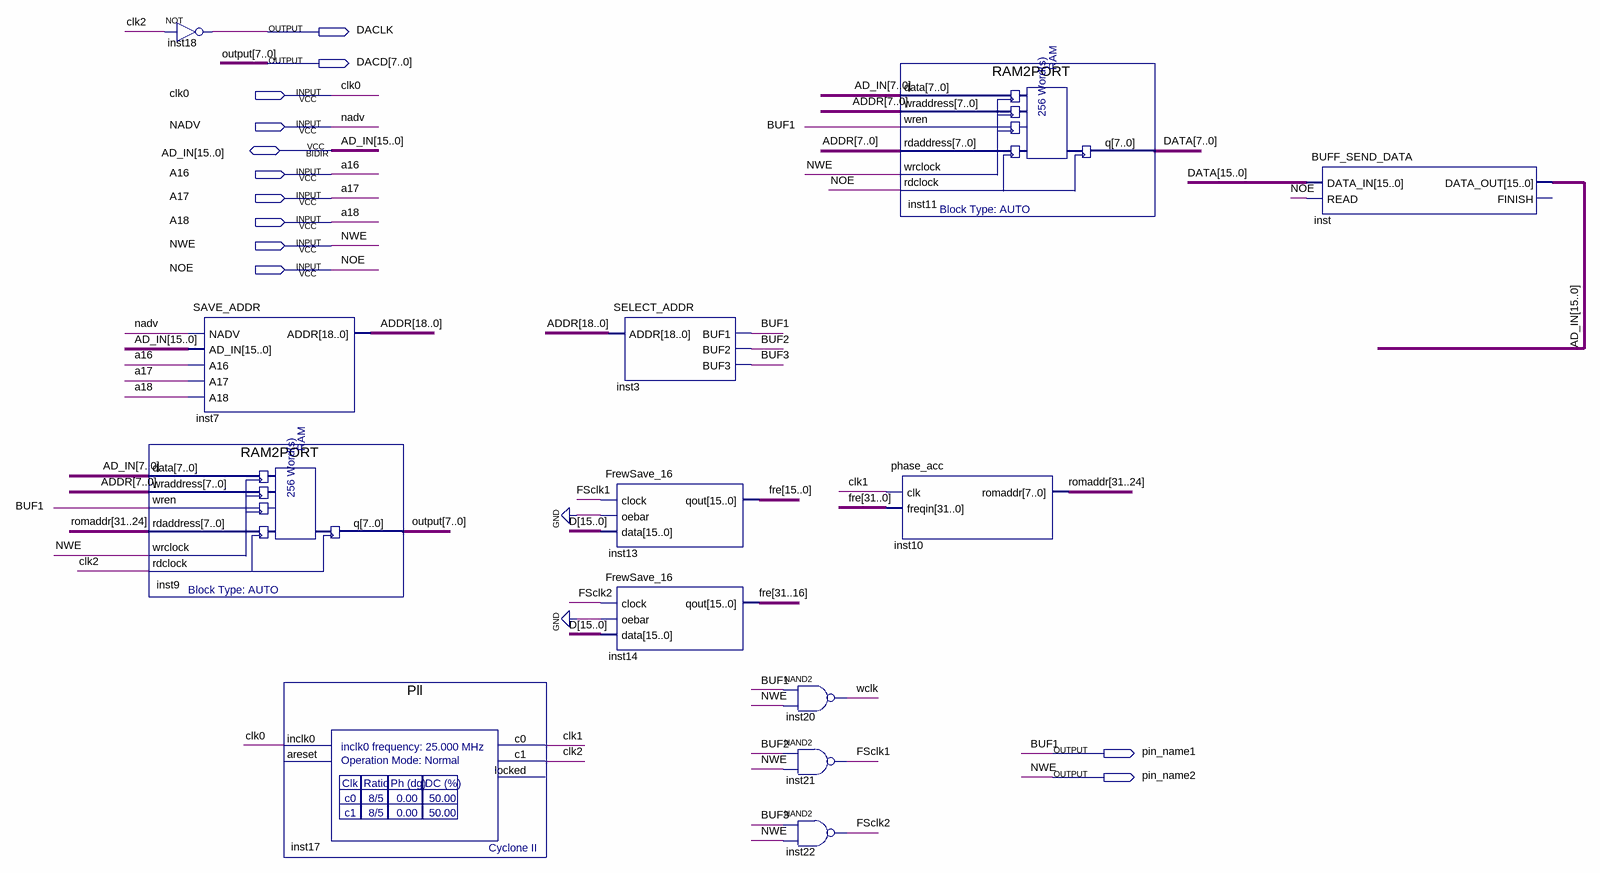
[diagram p0: schematic sheet]
// Quartus schematic dds_stm32.bdf as structural Verilog: 13 symbols, 12 pins
module dds_stm32 (
  input  clk0,
  input  NADV,
  input  A16,
  input  A17,
  input  A18,
  input  NWE,
  input  NOE,
  inout  [15:0] AD_IN,
  output DACLK,
  output [7:0] DACD,
  output pin_name1,
  output pin_name2
);

  wire BUF2, BUF3, clk1, clk2, FSclk1, FSclk2, wclk;
  wire [15:0] D, DATA;
  wire [18:0] ADDR;
  wire [31:0] fre;
  wire [31:24] romaddr;

  RAM2PORT inst9 (
    .data(AD_IN[7:0]), .wraddress(ADDR[7:0]), .wren(pin_name1), .rdaddress(romaddr), .wrclock(NWE),
    .rdclock(clk2), .q(DACD));
  not inst18 (DACLK, clk2);
  SAVE_ADDR inst7 (.NADV(NADV), .AD_IN(AD_IN), .A16(A16), .A17(A17), .A18(A18), .ADDR(ADDR));
  Pll inst17 (.inclk0(clk0), .c0(clk1), .c1(clk2));  // open: areset, locked
  SELECT_ADDR inst3 (.ADDR(ADDR), .BUF1(pin_name1), .BUF2(BUF2), .BUF3(BUF3));
  FrewSave_16 inst13 (.clock(FSclk1), .oebar(1'b0), .data(D), .qout(fre[15:0]));
  FrewSave_16 inst14 (.clock(FSclk2), .oebar(1'b0), .data(D), .qout(fre[31:16]));
  nand inst20 (wclk, pin_name1, NWE);
  nand inst21 (FSclk1, BUF2, NWE);
  nand inst22 (FSclk2, BUF3, NWE);
  RAM2PORT inst11 (
    .data(AD_IN[7:0]), .wraddress(ADDR[7:0]), .wren(pin_name1), .rdaddress(ADDR[7:0]), .wrclock(NWE),
    .rdclock(NOE), .q(DATA[7:0]));
  phase_acc inst10 (.clk(clk1), .freqin(fre), .romaddr(romaddr));
  BUFF_SEND_DATA inst (.DATA_IN(DATA), .READ(NOE), .DATA_OUT(AD_IN));  // open: FINISH

  assign pin_name2 = NWE;

  // Other names for the same wires on the sheet: BUF1 = pin_name1; output[7:0] = DACD
endmodule
